# Altium schematic sheet Sheet2.SchDoc
size A4
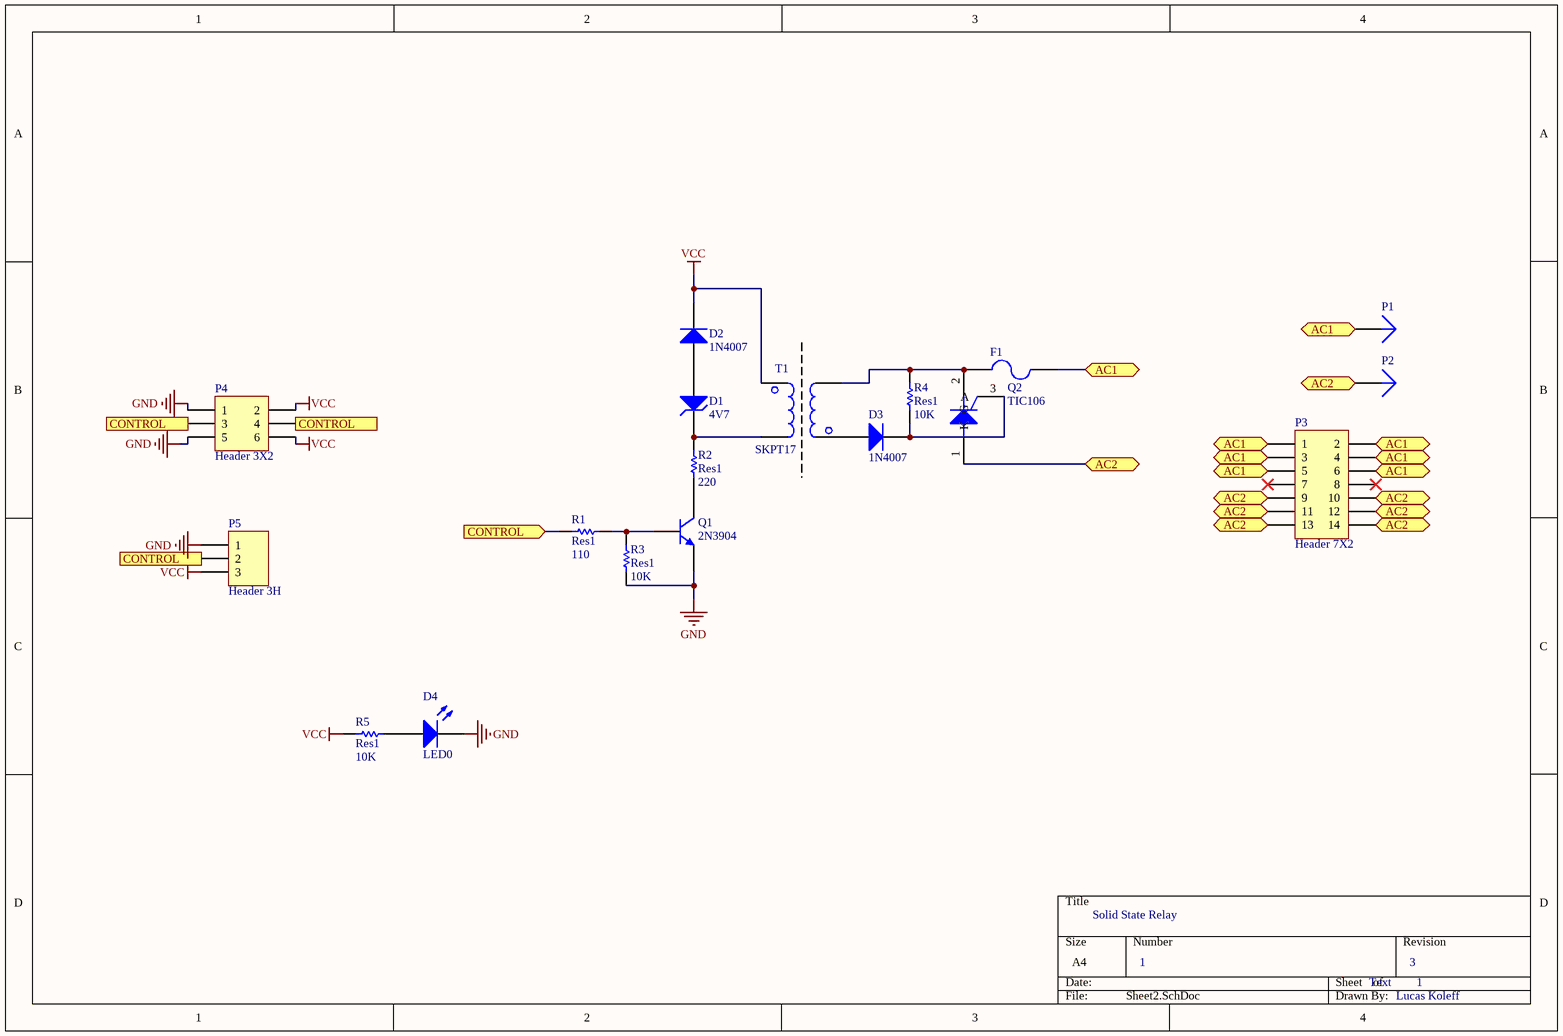
[diagram p0: Sheet2.SchDoc]

## Parts
D1  4V7  [DIODE-0.4]
D2  1N4007  [DIODE-0.4]
D3  1N4007  [DIODE-0.4]
D4  LED0  [LED-1]
F1  (no value)  [Fusivel]
P1  (no value)  [PIN1]
P2  (no value)  [PIN1]
P3  Header 7X2  [HDR2X7]
P4  Header 3X2  [HDR2X3]
P5  Header 3H  [HDR1X3H]
Q1  2N3904  [TO-92A]
Q2  TIC106  [TO-220-AB]
R1  Res1  value 110  [AXIAL-0.3]
R2  Res1  value 220  [AXIAL-0.3]
R3  Res1  value 10K  [AXIAL-0.3]
R4  Res1  value 10K  [AXIAL-0.3]
R5  Res1  value 10K  [AXIAL-0.3]
T1  SKPT17  [TrafoSKPT17]

## Ports
AC1 (bidir), AC2 (bidir), CONTROL (in)

## Nets
GND: D4.2(K) P4.1 P4.5 P5.1 Q1.1(E) R3.1
VCC: D2.2(K) P4.2 P4.6 P5.3 R5.1 T1.1
AC1: F1.2 P1.1 P3.1 P3.2 P3.3 P3.4 P3.5 P3.6 ; port AC1
AC2: P2.1 P3.9 P3.10 P3.11 P3.12 P3.13 P3.14 Q2.1(K) ; port AC2
CONTROL: P4.3 P4.4 P5.2 R1.2 ; port CONTROL
NetD1_1: D1.1(A) D2.1(A)
NetD1_2: D1.2(K) R2.2 T1.2
NetD3_1: D3.1(A) T1.4
NetD3_2: D3.2(K) Q2.3(A) R4.1
NetD4_1: D4.1(A) R5.2
NetF1_1: F1.1 Q2.2(G) R4.2 T1.3
NetQ1_2: Q1.2(B) R1.1 R3.2
NetQ1_3: Q1.3(C) R2.1

Not connected (* = marked no-connect by the designer): P3 7* 8*

## Notes on the sheet
- Solid State Relay
- 1
- Text
- 3
- Lucas Koleff

## Library data of the parts
D1 = D Zener: Zener Diode; Published: 8-Jun-2000; LatestRevisionDate: 17-Jul-2002; LatestRevisionNote: Re-released for DXP Platform.; PackageReference: DIODE-0.7; Publisher: Altium Limited; PackageDescription: Diode, Thru-Hole; 2 Leads; 0.7 in Pin Spacing
D2 D3 = Diode: Default Diode; Published: 8-Jun-2000; LatestRevisionDate: 17-Jul-2002; LatestRevisionNote: Re-released for DXP Platform.; PackageVersion: Sep-1996; PackageReference: SMC; Publisher: Altium Limited; PackageDescription: DO-214-AB/SMC; 2 C-Bend Leads; Body 7.9 x 5.9 mm, inc. leads (LxW); Code_JEDEC: DO-214-AB
D4 = LED0: Typical INFRARED GaAs LED; Published: 8-Jun-2000; LatestRevisionDate: 08-Jul-2005; LatestRevisionNote: Mech Layer 1 removed.; PackageReference: LED-0; Publisher: Altium Limited; PackageDescription: LED; 2 Leads
F1 = Fuse 2: Fuse; Published: 8-Jun-2000; LatestRevisionDate: 17-Jul-2002; LatestRevisionNote: Re-released for DXP Platform.; PackageReference: PIN-W2/E2.8; Publisher: Altium Limited; PackageDescription: Thru-Hole; 2 Leads
P1 P2 = Plug: LatestRevisionDate: 17-Jul-2002; LatestRevisionNote: Re-released for DXP Platform.; Publisher: Altium Limited
P3 = Header 7X2: Header, 7-Pin, Dual row; LatestRevisionDate: 17-Jul-2002; LatestRevisionNote: Re-released for DXP Platform.; Publisher: Altium Limited
P4 = Header 3X2: Header, 3-Pin, Dual row; LatestRevisionDate: 17-Jul-2002; LatestRevisionNote: Re-released for DXP Platform.; Publisher: Altium Limited
P5 = Header 3H: Header, 3-Pin, Right Angle; LatestRevisionDate: 17-Jul-2002; LatestRevisionNote: Re-released for DXP Platform.; Publisher: Altium Limited
Q1 = 2N3904: NPN General Purpose Amplifier; Published: 8-Jun-2000; LatestRevisionDate: 15-Jan-2003; LatestRevisionNote: PCB Footprint 'BCY-W3/D4.7' replaced; DatasheetVersion: 1997; PackageVersion: Sep-1998; PackageReference: TO-92A; Publisher: Altium Limited; PackageDescription: TO, Flat Index; 3 In-Line, Axial Leads; Body Dia. 4.5mm; Leads 0.51 x 0.48 mm (max); ComponentLink1Description: Manufacturer Link; ComponentLink1URL: http://www.fairchildsemi.com/; ComponentLink2Description: Datasheet; ComponentLink2URL: http://www.fairchildsemi.com/ds/2N%2F2N3904.pdf
Q2 = SCR: Silicon Controlled Rectifier; Published: 8-Jun-2000; LatestRevisionDate: 17-Jul-2002; LatestRevisionNote: Re-released for DXP Platform.; PackageReference: TO-220-AB; Publisher: Altium Limited; Code_JEDEC: TO-220-AB
R1-R5 = Res1: Resistor; Published: 8-Jun-2000; LatestRevisionDate: 17-Jul-2002; LatestRevisionNote: Re-released for DXP Platform.; PackageReference: AXIAL-0.3; Publisher: Altium Limited; PackageDescription: Axial Device, Thru-Hole; 2 Leads; 0.3 in Pin Spacing
T1 = Trans: Transformer; Published: 24-Mar-1999; LatestRevisionDate: 08-Jul-2005; LatestRevisionNote: Mech Layer 1 removed.; PackageReference: TRANS; Publisher: Altium Limited; PackageDescription: Transformer; 4 Leads